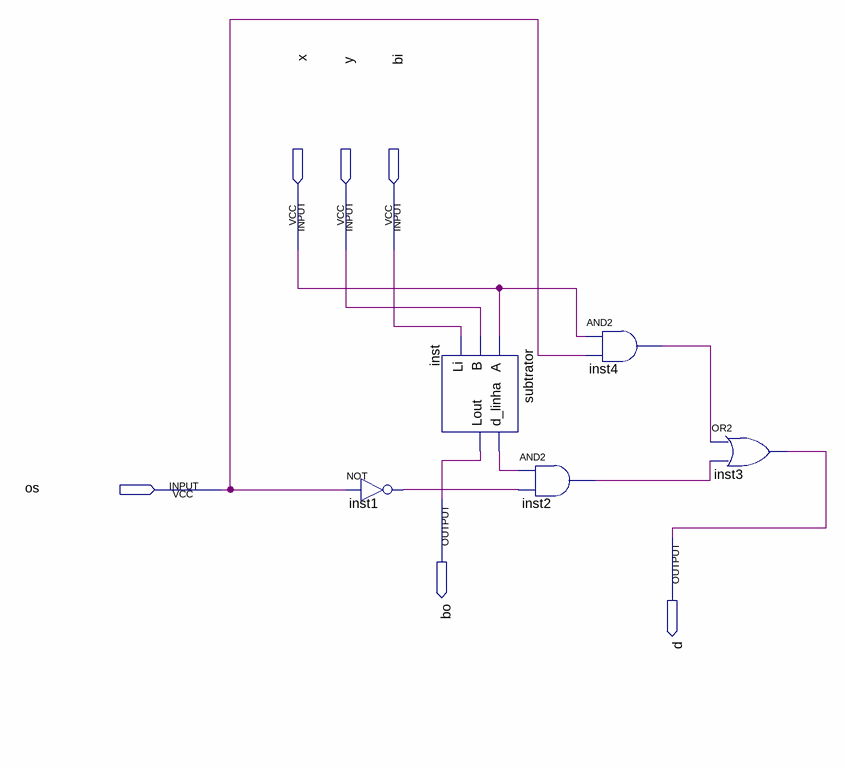
[diagram p0: schematic sheet]
// Quartus schematic divisor_de_1_bit.bdf as structural Verilog: 5 symbols, 6 pins
module divisor_de_1_bit (
  input  x,
  input  y,
  input  bi,
  input  os,
  output bo,
  output d
);

  wire inst1_out, inst2_out, inst4_out, inst_d_linha;

  not inst1 (inst1_out, os);
  subtrator inst (.A(x), .B(y), .Li(bi), .d_linha(inst_d_linha), .Lout(bo));
  and inst2 (inst2_out, inst_d_linha, inst1_out);
  and inst4 (inst4_out, x, os);
  or inst3 (d, inst4_out, inst2_out);
endmodule
